# EAGLE board EurocardBackplane-V1_0 (EAGLE 6.5.0)
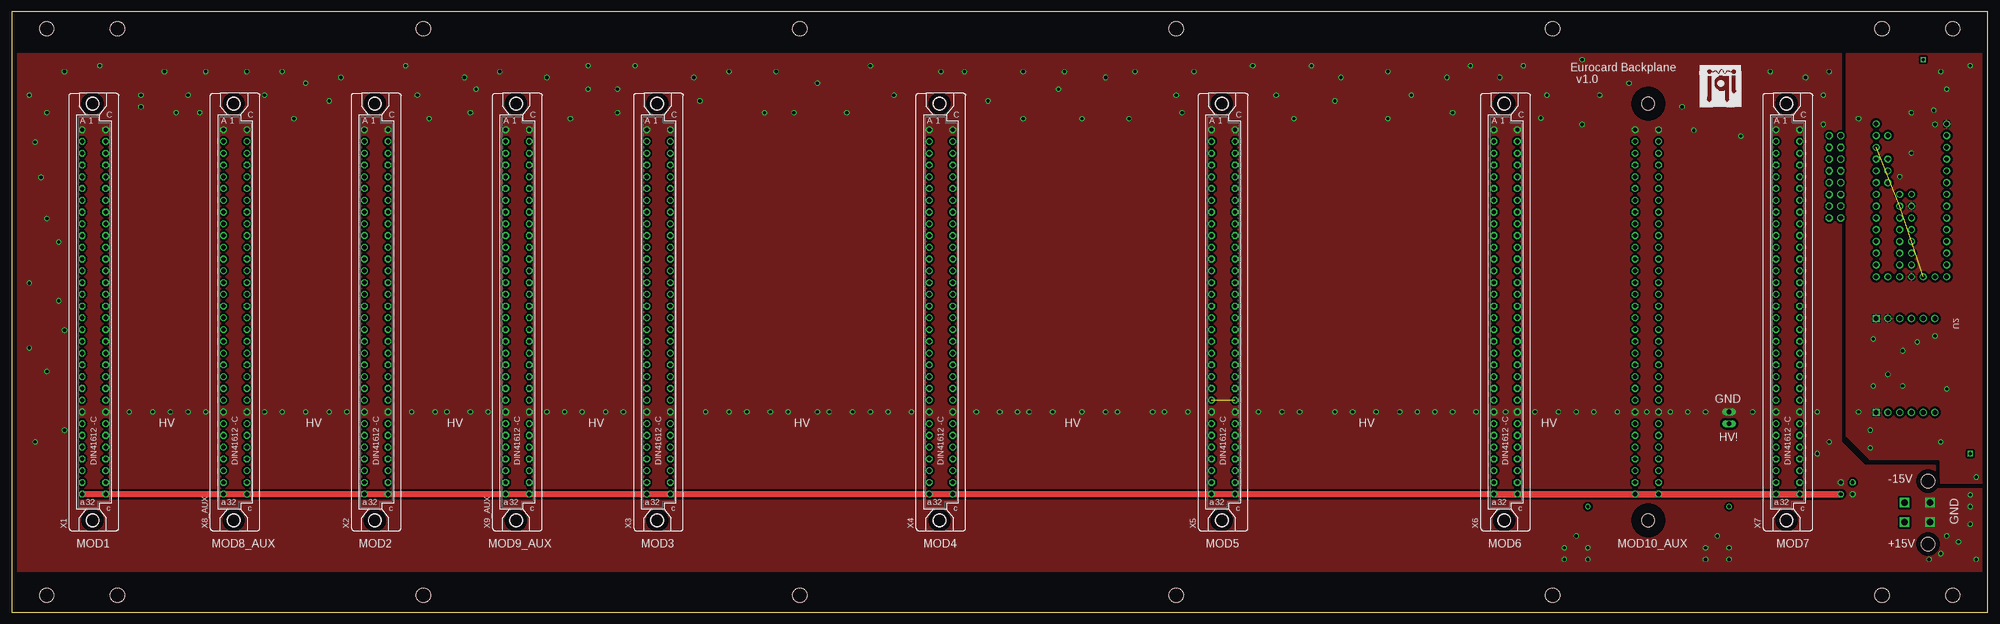
[diagram p3: board, top side]
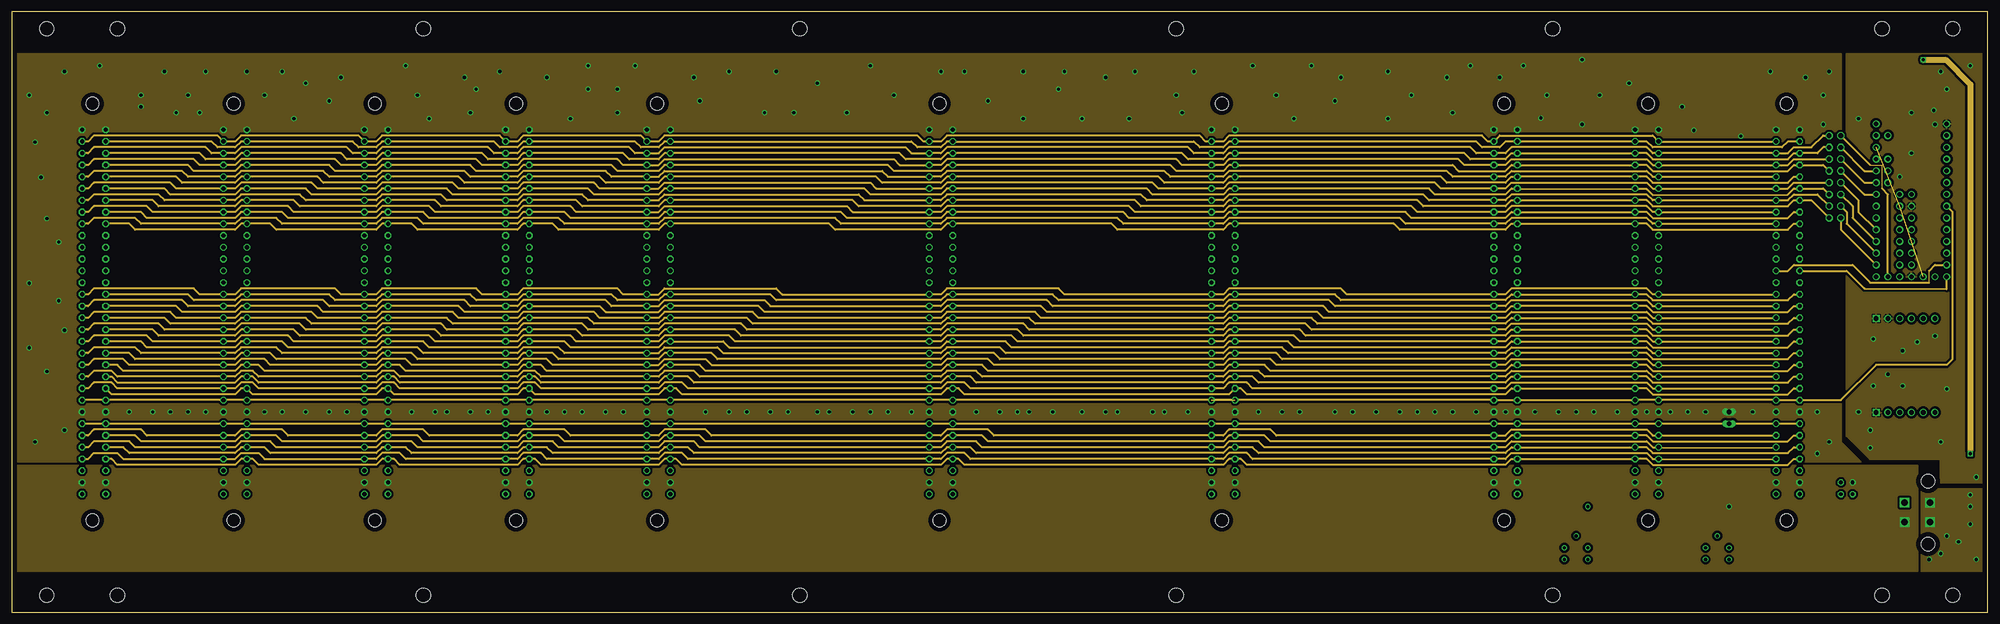
[diagram p4: board, inner layer Route2]
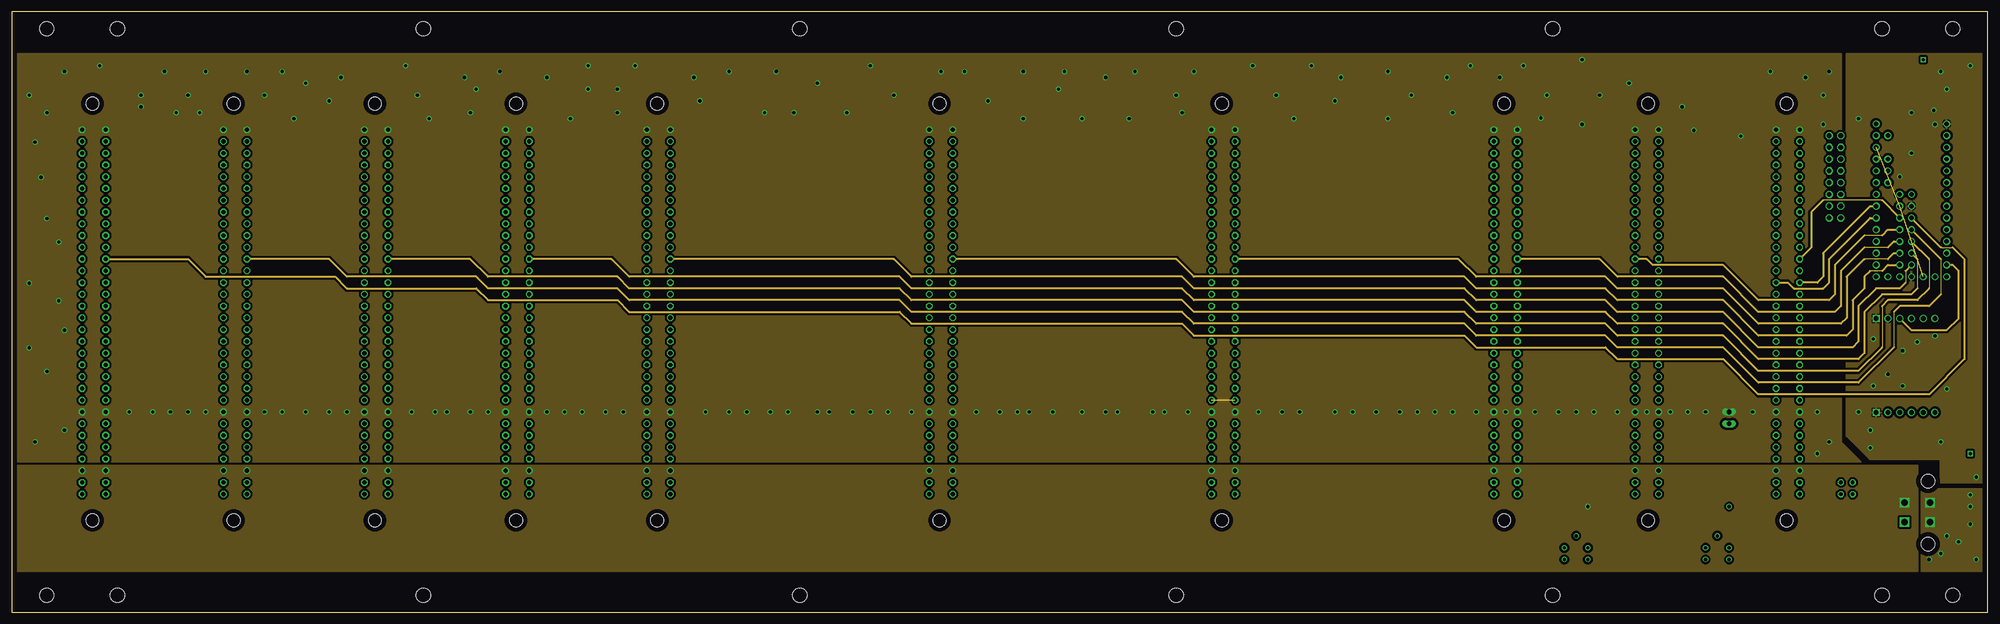
[diagram p5: board, inner layer Route15]
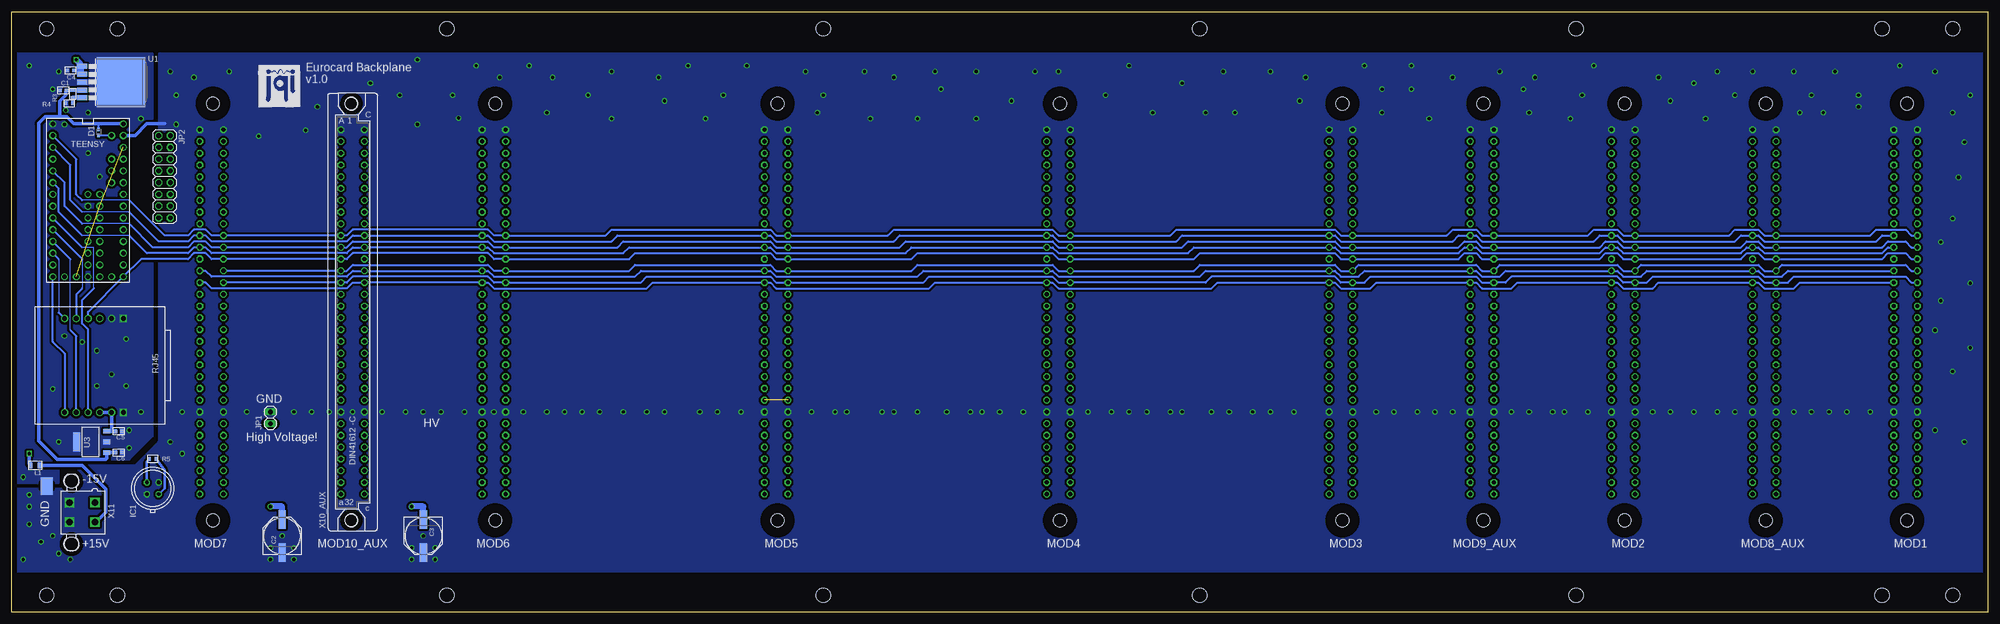
[diagram p6: board, bottom side, seen from below]

Size 426.72 x 129.79 mm. Coordinates in mm from the lower left corner, seen from the top.
Copper layers (1+2*15+16): Top 0.035mm / dielectric 1.5mm / Route2 0.035mm / dielectric 0.15mm / Route15 0.035mm / dielectric 0.2mm / Bottom 0.035mm
Design rules "default": minimum track width 10mil, minimum drill 24mil, track to track 8mil, track to pad 8mil, pad to pad 8mil, via to via 8mil, smd to smd 8mil, copper to edge 40mil, drill to drill 8mil, minimum pad ring 10mil, minimum via ring 8mil, stop-mask expansion 4mil, vias tented up to drill 0mil, thermal gap 10mil

## Footprints (pad centres in the part's own frame; a part is rotated, then mirrored left to right if it is on the bottom)
C_MLCC_0603 = smd 0.8 x 0.8: P$1 -0.75,0; P$2 0.75,0
PANASONIC_F = smd 4 x 1.6: + 3.55,0; - -3.55,0
SOD523 = smd 0.7 x 0.5: A 0.7,0; C -0.6,0
TO39/4 = drill 0.813 octagon: 1 -1.27,-1.27; 2 1.27,-1.27; 3 1.27,1.27; 4 -1.27,1.27
JUMP = smd 2.54 x 2.54: P$1 0,-1.27; P$2 0,0
1X02 = drill 1.016 long: 1 -1.27,0; 2 1.27,0
2X08 = drill 1.016 octagon: 1 -8.89,-1.27; 2 -8.89,1.27; 3 -6.35,-1.27; 4 -6.35,1.27; 5 -3.81,-1.27; 6 -3.81,1.27; 7 -1.27,-1.27; 8 -1.27,1.27; 9 1.27,-1.27; 10 1.27,1.27; 11 3.81,-1.27; 12 3.81,1.27; 13 6.35,-1.27; 14 6.35,1.27; 15 8.89,-1.27; 16 8.89,1.27
R_0805 = smd 0.7 x 1.3: P$1 -0.95,0; P$2 0.95,0
R_0603 = smd 0.6 x 0.9: P$1 -0.75,0; P$2 0.75,0
TEENSY_3.1_ALLPINS = drill 0.965: 0 -7.62,15.24; 1 -7.62,12.7; 2 -7.62,10.16; 3 -7.62,7.62; 3.3V 7.62,12.7; 3.3V1 -2.54,-15.24; 3.3V2 2.54,0; 4 -7.62,5.08; 5 -7.62,2.54; 6 -7.62,0; 7 -7.62,-2.54; 8 -7.62,-5.08; 9 -7.62,-7.62; 10 -7.62,-10.16; 11 -7.62,-12.7; 12 -7.62,-15.24; 13 7.62,-15.24; 14/A0 7.62,-12.7; 15/A1 7.62,-10.16; 16/A2 7.62,-7.62; 17/A3 7.62,-5.08; 18/A4 7.62,-2.54; 19/A5 7.62,0; 20/A6 7.62,2.54; 21/A7 7.62,5.08; 22/A8 7.62,7.62; 23/A9 7.62,10.16; 24 0,-2.54; 25 0,-5.08; 26 0,-7.62; 27 0,-10.16; 28 0,-12.7; 29 2.54,-12.7; 30 2.54,-10.16; 31 2.54,-7.62; 32 2.54,-5.08; 33 2.54,-2.54; A10 5.08,7.62; A11 5.08,5.08; A12 0,2.54; A13 2.54,2.54; A14 5.08,-15.24; AGND 7.62,15.24; AREF 5.08,10.16; GND -7.62,17.78; GND1 0,-15.24; GND2 0,0; PGM 2.54,-15.24; VBAT -5.08,-15.24; VIN 7.62,17.78; VUSB 5.08,15.24
TO263-5 = smd 1.067 x 2.159: 1 -3.404,-5.791; 2 -1.702,-5.791; 3 0,-5.791; 4 1.702,-5.791; 5 3.404,-5.791 | smd 10.8 x 10.41: 6 0,2.54
WIZNET = drill 1.016: 3V3A 10.16,5.08; 3V3B 10.16,2.54; GND2 -10.16,5.08; INT -10.16,-5.08; MISO 10.16,-5.08; MOSI -10.16,2.54; PWDN 10.16,0; RESET 10.16,-2.54; SCLK -10.16,0; SS -10.16,-2.54 | drill 1.016 square: GND1 -10.16,7.62; GND3 10.16,7.62
SOT223-S = smd 1 x 1.5: 1 -2.3,-1.5; 2 0,-1.5; 3 2.3,-1.5 | smd 4 x 1.5: 4 0,5
BACKPLANE = hole 3.099: 7.62,126.111; 22.86,126.111; 88.9,126.111; 170.18,126.111; 251.46,126.111; 332.74,126.111; 419.1,126.111; 403.86,126.111; 7.62,3.683; 22.86,3.683; 88.9,3.683; 170.18,3.683; 251.46,3.683; 332.74,3.683; 419.1,3.683; 403.86,3.683
FAC64S = drill 0.914 octagon: A1 -2.54,39.37; A2 -2.54,36.83; A3 -2.54,34.29; A4 -2.54,31.75; A5 -2.54,29.21; A6 -2.54,26.67; A7 -2.54,24.13; A8 -2.54,21.59; A9 -2.54,19.05; A10 -2.54,16.51; A11 -2.54,13.97; A12 -2.54,11.43; A13 -2.54,8.89; A14 -2.54,6.35; A15 -2.54,3.81; A16 -2.54,1.27; A17 -2.54,-1.27; A18 -2.54,-3.81; A19 -2.54,-6.35; A20 -2.54,-8.89; A21 -2.54,-11.43; A22 -2.54,-13.97; A23 -2.54,-16.51; A24 -2.54,-19.05; A25 -2.54,-21.59; A26 -2.54,-24.13; A27 -2.54,-26.67; A28 -2.54,-29.21; A29 -2.54,-31.75; A30 -2.54,-34.29; A31 -2.54,-36.83; A32 -2.54,-39.37; C1 2.54,39.37; C2 2.54,36.83; C3 2.54,34.29; C4 2.54,31.75; C5 2.54,29.21; C6 2.54,26.67; C7 2.54,24.13; C8 2.54,21.59; C9 2.54,19.05; C10 2.54,16.51; C11 2.54,13.97; C12 2.54,11.43; C13 2.54,8.89; C14 2.54,6.35; C15 2.54,3.81; C16 2.54,1.27; C17 2.54,-1.27; C18 2.54,-3.81; C19 2.54,-6.35; C20 2.54,-8.89; C21 2.54,-11.43; C22 2.54,-13.97; C23 2.54,-16.51; C24 2.54,-19.05; C25 2.54,-21.59; C26 2.54,-24.13; C27 2.54,-26.67; C28 2.54,-29.21; C29 2.54,-31.75; C30 2.54,-34.29; C31 2.54,-36.83; C32 2.54,-39.37 | hole 2.794: -0.305,45.009; -0.305,-45.009
5566-4 = drill 1.4 square: 1 2.1,-2.75; 2 -2.1,-2.75; 3 2.1,2.75; 4 -2.1,2.75 | hole 3: 6.8,2.29; -6.8,2.29

## Placement (x,y rotation side)
C1  1uF  [C_MLCC_0603]  415.54,112.78 0 bottom
C2  [PANASONIC_F]  368.3,16.51 90 bottom
C3  [PANASONIC_F]  337.82,16.51 270 bottom
C4  1uF  [C_MLCC_0603]  414.02,117.09 0 bottom
C5  1uF  [C_MLCC_0603]  403.61,39.12 180 bottom
C6  1uF  [C_MLCC_0603]  403.61,34.54 180 bottom
D1  [SOD523]  407.92,103.76 270 bottom
IC1  LM399H  [TO39/4]  396.24,26.8 90 bottom
J1  JUMPER  [JUMP]  419.1,26.67 180 bottom
JP1  [1X02]  370.84,42.04 90 bottom
JP2  [2X08]  393.7,94.11 270 bottom
L1  [R_0805]  421.64,31.75 180 bottom
R3  [R_0603]  413.51,112.01 90 bottom
R4  [R_0603]  414.27,109.98 0 bottom
R5  7.5k  [R_0603]  396.24,33.15 180 bottom
TEENSY  TEENSY_3.1_ALL_PINS_AND_PADS  [TEENSY_3.1_ALLPINS]  410.21,87.76 0 bottom
U1  MIC5209  [TO263-5]  405.64,114.55 270 bottom
U2  WIZ820IO  [WIZNET]  410.21,53.34 270 bottom
U3  MIC5209-3.3YS  [SOT223-S]  407.67,36.83 90 bottom
U$1  [JQI_LOGO_NEGATIVE-SILKSCREEN]  364.49,109.22 0 top
U$3  [BACKPLANE]  0,0 0 top
U$4  [JQI_LOGO_NEGATIVE-SILKSCREEN]  373.38,109.22 0 bottom
X1  FAC64S  [FAC64S]  17.78,64.9 0 top
X2  FAC64S  [FAC64S]  78.74,64.9 0 top
X3  FAC64S  [FAC64S]  139.7,64.9 0 top
X4  FAC64S  [FAC64S]  200.66,64.9 0 top
X5  FAC64S  [FAC64S]  261.62,64.9 0 top
X6  FAC64S  [FAC64S]  322.58,64.9 0 top
X7  FAC64S  [FAC64S]  383.54,64.9 0 top
X8_AUX  FAC64S  [FAC64S]  48.26,64.9 0 top
X9_AUX  FAC64S  [FAC64S]  109.22,64.9 0 top
X10_AUX  FAC64S  [FAC64S]  353.06,64.9 0 bottom
X11  [5566-4]  411.48,21.59 90 bottom

## Tracks (layer width: path | path; a pad name or v marks a point on that pad's centre or on a via)
3.3V  (2 unrouted)
+3V3
  Bottom 0.762: C5.P$2 405.13,39.12 | 405.13,39.12 406.16,39.12 U3.3 | U2.3V3B U2.3V3A 405.13,39.12
+15V  (via drill 0.7)
  Bottom 0.508: IC1.3 397.51,32.5 R5.P$2
  Bottom 0.762: L1.P$1 411.48,31.75 406.4,26.67 406.4,21.59 408.5,19.49 X11.2
  Bottom 1.27: C2.+ 368.3,22.86 v370.84,22.86
  pour Route2 (isolate 0.508, no thermals): 411.48,31.75 411.48,8.89 0,8.89 0,31.75
-15V  (via drill 0.7)
  Bottom 1.27: C3.- 337.82,22.86 v340.36,22.86
  pour Route15 (isolate 0.508, no thermals): 411.48,31.75 411.48,8.89 0,8.89 0,31.75
A2
  Route2 0.406: 380.87,101.6 X7.A2 X10_AUX.A2 354.33,103 321.31,103 X6.A2 318.77,101.73 317.5,103 262.89,103 261.62,101.73 X5.A2 257.81,101.73 256.54,103 201.93,103 200.66,101.73 X4.A2 196.85,101.73 195.58,103 140.97,103 139.7,101.73 X3.A2 135.89,103 110.49,103 109.22,101.73 X9_AUX.A2 105.41,103 80.01,103 78.74,101.73 X2.A2 74.93,103 49.53,103 48.26,101.73 X8_AUX.A2 44.45,103 17.78,103 16.51,101.73 X1.A2
A5
  Route2 0.406: X7.A5 X10_AUX.A5 354.33,94.11 353.06,95.38 323.85,95.38 322.58,94.11 X6.A5 311.15,94.11 309.88,95.38 262.89,95.38 261.62,94.11 X5.A5 250.19,94.11 248.92,95.38 201.93,95.38 200.66,94.11 X4.A5 189.23,94.11 187.96,95.38 140.97,95.38 139.7,94.11 X3.A5 129.54,94.11 128.27,95.38 110.49,95.38 109.22,94.11 X9_AUX.A5 99.06,94.11 97.79,95.38 80.01,95.38 78.74,94.11 X2.A5 68.58,94.11 67.31,95.38 49.53,95.38 48.26,94.11 X8_AUX.A5 38.1,94.11 36.83,95.38 17.78,95.38 16.51,94.11 X1.A5
A8
  Route2 0.406: X7.A8 X10_AUX.A8 354.33,86.49 353.06,87.76 323.85,87.76 322.58,86.49 X6.A8 303.53,86.49 302.26,87.76 262.89,87.76 261.62,86.49 X5.A8 242.57,86.49 241.3,87.76 201.93,87.76 200.66,86.49 X4.A8 181.61,86.49 180.34,87.76 140.97,87.76 139.7,86.49 X3.A8 121.92,86.49 120.65,87.76 110.49,87.76 109.22,86.49 X9_AUX.A8 91.44,86.49 90.17,87.76 80.01,87.76 78.74,86.49 X2.A8 60.96,86.49 59.69,87.76 49.53,87.76 48.26,86.49 X8_AUX.A8 30.48,86.49 29.21,87.76 17.78,87.76 16.51,86.49 X1.A8
A9
  Route2 0.406: X7.A9 X10_AUX.A9 354.33,83.95 353.06,85.22 323.85,85.22 322.58,83.95 X6.A9 300.99,83.95 299.72,85.22 262.89,85.22 261.62,83.95 X5.A9 240.03,83.95 238.76,85.22 201.93,85.22 200.66,83.95 X4.A9 179.07,83.95 177.8,85.22 140.97,85.22 139.7,83.95 X3.A9 119.38,83.95 118.11,85.22 110.49,85.22 109.22,83.95 X9_AUX.A9 88.9,83.95 87.63,85.22 80.01,85.22 78.74,83.95 X2.A9 58.42,83.95 57.15,85.22 49.53,85.22 48.26,83.95 X8_AUX.A9 27.94,83.95 26.67,85.22 17.78,85.22 16.51,83.95 X1.A9
A15
  Route2 0.406: X7.A15 X10_AUX.A15 354.33,68.71 353.06,69.98 323.85,69.98 322.58,68.71 X6.A15 288.29,68.71 287.02,69.98 262.89,69.98 261.62,68.71 X5.A15 227.33,68.71 226.06,69.98 201.93,69.98 200.66,68.71 X4.A15 166.37,68.71 165.1,69.98 140.97,69.98 139.7,68.71 X3.A15 132.08,68.71 130.81,69.98 110.49,69.98 109.22,68.71 X9_AUX.A15 101.6,68.71 100.33,69.98 80.01,69.98 78.74,68.71 X2.A15 71.12,68.71 69.85,69.98 49.53,69.98 48.26,68.71 X8_AUX.A15 40.64,68.71 39.37,69.98 17.78,69.98 16.51,68.71 X1.A15
A16
  Route2 0.406: X7.A16 X10_AUX.A16 354.33,66.17 353.06,67.44 323.85,67.44 322.58,66.17 X6.A16 285.75,66.17 284.48,67.44 262.89,67.44 261.62,66.17 X5.A16 224.79,66.17 223.52,67.44 201.93,67.44 200.66,66.17 X4.A16 163.83,66.17 162.56,67.44 140.97,67.44 139.7,66.17 X3.A16 129.54,66.17 128.27,67.44 110.49,67.44 109.22,66.17 X9_AUX.A16 99.06,66.17 97.79,67.44 80.01,67.44 78.74,66.17 X2.A16 68.58,66.17 67.31,67.44 49.53,67.44 48.26,66.17 X8_AUX.A16 38.1,66.17 36.83,67.44 17.78,67.44 16.51,66.17 X1.A16
A17
  Route2 0.406: X7.A17 X10_AUX.A17 354.33,63.63 353.06,64.9 323.85,64.9 322.58,63.63 X6.A17 283.21,63.63 281.94,64.9 262.89,64.9 261.62,63.63 X5.A17 222.25,63.63 220.98,64.9 201.93,64.9 200.66,63.63 X4.A17 161.29,63.63 160.02,64.9 140.97,64.9 139.7,63.63 X3.A17 127,63.63 125.73,64.9 110.49,64.9 109.22,63.63 X9_AUX.A17 96.52,63.63 95.25,64.9 80.01,64.9 78.74,63.63 X2.A17 66.04,63.63 64.77,64.9 49.53,64.9 48.26,63.63 X8_AUX.A17 35.56,63.63 34.29,64.9 17.78,64.9 16.51,63.63 X1.A17
A18
  Route2 0.406: X7.A18 X10_AUX.A18 354.33,61.09 353.06,62.36 323.85,62.36 322.58,61.09 X6.A18 280.67,61.09 279.4,62.36 262.89,62.36 261.62,61.09 X5.A18 219.71,61.09 218.44,62.36 201.93,62.36 200.66,61.09 X4.A18 158.75,61.09 157.48,62.36 140.97,62.36 139.7,61.09 X3.A18 124.46,61.09 123.19,62.36 110.49,62.36 109.22,61.09 X9_AUX.A18 93.98,61.09 92.71,62.36 80.01,62.36 78.74,61.09 X2.A18 63.5,61.09 62.23,62.36 49.53,62.36 48.26,61.09 X8_AUX.A18 33.02,61.09 31.75,62.36 17.78,62.36 16.51,61.09 X1.A18
A19
  Route2 0.406: X7.A19 X10_AUX.A19 354.33,58.55 353.06,59.82 323.85,59.82 322.58,58.55 X6.A19 278.13,58.55 276.86,59.82 262.89,59.82 261.62,58.55 X5.A19 217.17,58.55 215.9,59.82 201.93,59.82 200.66,58.55 X4.A19 156.21,58.55 154.94,59.82 140.97,59.82 139.7,58.55 X3.A19 121.92,58.55 120.65,59.82 110.49,59.82 109.22,58.55 X9_AUX.A19 91.44,58.55 90.17,59.82 80.01,59.82 78.74,58.55 X2.A19 60.96,58.55 59.69,59.82 49.53,59.82 48.26,58.55 X8_AUX.A19 30.48,58.55 29.21,59.82 17.78,59.82 16.51,58.55 X1.A19
A20
  Route2 0.406: X7.A20 X10_AUX.A20 354.33,56.01 353.06,57.28 323.85,57.28 322.58,56.01 X6.A20 275.59,56.01 274.32,57.28 262.89,57.28 261.62,56.01 X5.A20 214.63,56.01 213.36,57.28 201.93,57.28 200.66,56.01 X4.A20 153.67,56.01 152.4,57.28 140.97,57.28 139.7,56.01 X3.A20 119.38,56.01 118.11,57.28 110.49,57.28 109.22,56.01 X9_AUX.A20 88.9,56.01 87.63,57.28 80.01,57.28 78.74,56.01 X2.A20 58.42,56.01 57.15,57.28 49.53,57.28 48.26,56.01 X8_AUX.A20 27.94,56.01 26.67,57.28 17.78,57.28 16.51,56.01 X1.A20
A21
  Route2 0.406: X7.A21 381,53.34 X10_AUX.A21 354.33,53.47 353.06,54.74 323.85,54.74 322.58,53.47 X6.A21 273.05,53.47 271.78,54.74 262.89,54.74 261.62,53.47 X5.A21 212.09,53.47 210.82,54.74 201.93,54.74 200.66,53.47 X4.A21 151.13,53.47 149.86,54.74 140.97,54.74 139.7,53.47 X3.A21 116.84,53.47 115.57,54.74 110.49,54.74 109.22,53.47 X9_AUX.A21 86.36,53.47 85.09,54.74 80.01,54.74 78.74,53.47 X2.A21 55.88,53.47 54.61,54.74 49.53,54.74 48.26,53.47 X8_AUX.A21 25.4,53.47 24.13,54.74 17.78,54.74 16.51,53.47 X1.A21
A22
  Route2 0.406: X7.A22 X10_AUX.A22 354.33,50.93 353.06,52.2 323.85,52.2 322.58,50.93 X6.A22 270.51,50.93 269.24,52.2 262.89,52.2 261.62,50.93 X5.A22 209.55,50.93 208.28,52.2 201.93,52.2 200.66,50.93 X4.A22 148.59,50.93 147.32,52.2 140.97,52.2 139.7,50.93 X3.A22 114.3,50.93 113.03,52.2 110.49,52.2 109.22,50.93 X9_AUX.A22 83.82,50.93 82.55,52.2 80.01,52.2 78.74,50.93 X2.A22 53.34,50.93 52.07,52.2 49.53,52.2 48.26,50.93 X8_AUX.A22 22.86,50.93 21.59,52.2 17.78,52.2 16.51,50.93 X1.A22
A23
  Route2 0.406: X7.A23 X10_AUX.A23 354.33,48.39 353.06,49.66 323.85,49.66 322.58,48.39 X6.A23 267.97,48.39 266.7,49.66 262.89,49.66 261.62,48.39 X5.A23 207.01,48.39 205.74,49.66 201.93,49.66 200.66,48.39 X4.A23 146.05,48.39 144.78,49.66 140.97,49.66 139.7,48.39 X3.A23 114.3,48.39 113.03,49.66 110.49,49.66 109.22,48.39 X9_AUX.A23 83.82,48.39 82.55,49.66 80.01,49.66 78.74,48.39 X2.A23 53.34,48.39 52.07,49.66 49.53,49.66 48.26,48.39 X8_AUX.A23 22.86,48.39 21.59,49.66 17.78,49.66 16.51,48.39 X1.A23
A27
  Route2 0.406: X7.A27 X10_AUX.A27 354.33,38.23 353.06,39.5 323.85,39.5 322.58,38.23 X6.A27 273.05,38.23 271.78,39.5 262.89,39.5 261.62,38.23 X5.A27 212.09,38.23 210.82,39.5 201.93,39.5 200.66,38.23 X4.A27 151.13,38.23 149.86,39.5 140.97,39.5 139.7,38.23 X3.A27 120.65,38.23 119.38,39.5 110.49,39.5 109.22,38.23 X9_AUX.A27 90.17,38.23 88.9,39.5 80.01,39.5 78.74,38.23 X2.A27 59.69,38.23 58.42,39.5 49.53,39.5 48.26,38.23 X8_AUX.A27 29.21,38.23 27.94,39.5 17.78,39.5 16.51,38.23 X1.A27
A28
  Route2 0.406: X7.A28 381,35.56 X10_AUX.A28 354.33,35.69 353.06,36.96 323.85,36.96 322.58,35.69 X6.A28 270.51,35.69 269.24,36.96 262.89,36.96 261.62,35.69 X5.A28 209.55,35.69 208.28,36.96 201.93,36.96 200.66,35.69 X4.A28 148.59,35.69 147.32,36.96 140.97,36.96 139.7,35.69 X3.A28 118.11,35.69 116.84,36.96 110.49,36.96 109.22,35.69 X9_AUX.A28 87.63,35.69 86.36,36.96 80.01,36.96 78.74,35.69 X2.A28 57.15,35.69 55.88,36.96 49.53,36.96 48.26,35.69 X8_AUX.A28 26.67,35.69 25.4,36.96 17.78,36.96 16.51,35.69 X1.A28
A29
  Route2 0.406: X7.A29 381,33.02 X10_AUX.A29 354.33,33.15 353.06,34.42 323.85,34.42 322.58,33.15 X6.A29 267.97,33.15 266.7,34.42 262.89,34.42 261.62,33.15 X5.A29 207.01,33.15 205.74,34.42 201.93,34.42 200.66,33.15 X4.A29 146.05,33.15 144.78,34.42 140.97,34.42 139.7,33.15 X3.A29 115.57,33.15 114.3,34.42 110.49,34.42 109.22,33.15 X9_AUX.A29 85.09,33.15 83.82,34.42 80.01,34.42 78.74,33.15 X2.A29 54.61,33.15 53.34,34.42 49.53,34.42 48.26,33.15 X8_AUX.A29 24.13,33.15 22.86,34.42 17.78,34.42 16.51,33.15 X1.A29
C2
  Route2 0.406: 386.08,101.6 X7.C2 383.54,101.73 382.27,100.46 354.33,100.46 353.06,101.73 X10_AUX.C2 X6.C2 | 325.25,101.6 X6.C2 | X6.C2 322.58,101.73 321.31,100.46 317.5,100.46 316.23,101.73 X5.C2 262.89,101.73 261.62,100.46 256.54,100.46 255.27,101.73 X4.C2 201.93,101.73 200.66,100.46 195.58,100.46 194.31,101.73 X3.C2 140.97,101.73 139.7,100.46 135.89,100.46 134.62,101.73 X9_AUX.C2 110.49,101.73 109.22,100.46 105.41,100.46 104.14,101.73 X2.C2 80.01,101.73 78.74,100.46 74.93,100.46 73.66,101.73 X8_AUX.C2 49.53,101.73 48.26,100.46 44.45,100.46 43.18,101.73 X1.C2
C5
  Route2 0.406: 386.08,93.98 X7.C5 384.81,94.11 383.54,92.84 354.33,92.84 353.06,94.11 X10_AUX.C5 X6.C5 323.85,94.11 322.58,92.84 309.88,92.84 308.61,94.11 X5.C5 262.89,94.11 261.62,92.84 248.92,92.84 247.65,94.11 X4.C5 201.93,94.11 200.66,92.84 187.96,92.84 186.69,94.11 X3.C5 140.97,94.11 139.7,92.84 128.27,92.84 127,94.11 X9_AUX.C5 110.49,94.11 109.22,92.84 97.79,92.84 96.52,94.11 X2.C5 80.01,94.11 78.74,92.84 67.31,92.84 66.04,94.11 X8_AUX.C5 49.53,94.11 48.26,92.84 36.83,92.84 35.56,94.11 X1.C5
C8
  Route2 0.406: X7.C8 384.81,86.49 383.54,85.22 354.33,85.22 353.06,86.49 X10_AUX.C8 X6.C8 323.85,86.49 322.58,85.22 302.26,85.22 300.99,86.49 X5.C8 262.89,86.49 261.62,85.22 241.3,85.22 240.03,86.49 X4.C8 201.93,86.49 200.66,85.22 180.34,85.22 179.07,86.49 X3.C8 140.97,86.49 139.7,85.22 120.65,85.22 119.38,86.49 X9_AUX.C8 110.49,86.49 109.22,85.22 90.17,85.22 88.9,86.49 X2.C8 80.01,86.49 78.74,85.22 59.69,85.22 58.42,86.49 X8_AUX.C8 49.53,86.49 48.26,85.22 29.21,85.22 27.94,86.49 X1.C8
C9
  Route2 0.406: X7.C9 384.81,83.95 383.54,82.68 354.33,82.68 353.06,83.95 X10_AUX.C9 X6.C9 323.85,83.95 322.58,82.68 299.72,82.68 298.45,83.95 X5.C9 262.89,83.95 261.62,82.68 238.76,82.68 237.49,83.95 X4.C9 201.93,83.95 200.66,82.68 177.8,82.68 176.53,83.95 X3.C9 140.97,83.95 139.7,82.68 118.11,82.68 116.84,83.95 X9_AUX.C9 110.49,83.95 109.22,82.68 87.63,82.68 86.36,83.95 X2.C9 80.01,83.95 78.74,82.68 57.15,82.68 55.88,83.95 X8_AUX.C9 49.53,83.95 48.26,82.68 26.67,82.68 25.4,83.95 X1.C9
C15
  Route2 0.406: X7.C15 384.81,68.71 383.54,67.44 354.33,67.44 353.06,68.71 X10_AUX.C15 X6.C15 323.85,68.71 322.58,67.44 287.02,67.44 285.75,68.71 X5.C15 262.89,68.71 261.62,67.44 226.06,67.44 224.79,68.71 X4.C15 201.93,68.71 200.66,67.44 165.1,67.44 163.83,68.71 X3.C15 140.97,68.71 139.7,67.44 130.81,67.44 129.54,68.71 X9_AUX.C15 110.49,68.71 109.22,67.44 100.33,67.44 99.06,68.71 X2.C15 80.01,68.71 78.74,67.44 69.85,67.44 68.58,68.71 X8_AUX.C15 49.53,68.71 48.26,67.44 39.37,67.44 38.1,68.71 X1.C15
C16
  Route2 0.406: X7.C16 384.81,66.17 383.54,64.9 354.33,64.9 353.06,66.17 X10_AUX.C16 | 350.39,66.17 X10_AUX.C16 | X10_AUX.C16 X6.C16 323.85,66.17 322.58,64.9 284.48,64.9 283.21,66.17 X5.C16 262.89,66.17 261.62,64.9 223.52,64.9 222.25,66.17 X4.C16 201.93,66.17 200.66,64.9 162.56,64.9 161.29,66.17 X3.C16 140.97,66.17 139.7,64.9 128.27,64.9 127,66.17 X9_AUX.C16 110.49,66.17 109.22,64.9 97.79,64.9 96.52,66.17 X2.C16 80.01,66.17 78.74,64.9 67.31,64.9 66.04,66.17 X8_AUX.C16 49.53,66.17 48.26,64.9 36.83,64.9 35.56,66.17 X1.C16
C17
  Route2 0.406: X7.C17 384.81,63.63 383.54,62.36 354.33,62.36 353.06,63.63 X10_AUX.C17 X6.C17 323.85,63.63 322.58,62.36 281.94,62.36 280.67,63.63 X5.C17 262.89,63.63 261.62,62.36 220.98,62.36 219.71,63.63 X4.C17 201.93,63.63 200.66,62.36 160.02,62.36 158.75,63.63 X3.C17 140.97,63.63 139.7,62.36 125.73,62.36 124.46,63.63 X9_AUX.C17 110.49,63.63 109.22,62.36 95.25,62.36 93.98,63.63 X2.C17 80.01,63.63 78.74,62.36 64.77,62.36 63.5,63.63 X8_AUX.C17 49.53,63.63 48.26,62.36 34.29,62.36 33.02,63.63 X1.C17
C18
  Route2 0.406: X7.C18 384.81,61.09 383.54,59.82 354.33,59.82 353.06,61.09 X10_AUX.C18 X6.C18 323.85,61.09 322.58,59.82 279.4,59.82 278.13,61.09 X5.C18 262.89,61.09 261.62,59.82 218.44,59.82 217.17,61.09 X4.C18 201.93,61.09 200.66,59.82 157.48,59.82 156.21,61.09 X3.C18 140.97,61.09 139.7,59.82 123.19,59.82 121.92,61.09 X9_AUX.C18 110.49,61.09 109.22,59.82 92.71,59.82 91.44,61.09 X2.C18 80.01,61.09 78.74,59.82 62.23,59.82 60.96,61.09 X8_AUX.C18 49.53,61.09 48.26,59.82 31.75,59.82 30.48,61.09 X1.C18
C19
  Route2 0.406: X7.C19 384.81,58.55 383.54,57.28 354.33,57.28 353.06,58.55 X10_AUX.C19 X6.C19 323.85,58.55 322.58,57.28 276.86,57.28 275.59,58.55 X5.C19 262.89,58.55 261.62,57.28 215.9,57.28 214.63,58.55 X4.C19 201.93,58.55 200.66,57.28 154.94,57.28 153.67,58.55 X3.C19 140.97,58.55 139.7,57.28 120.65,57.28 119.38,58.55 X9_AUX.C19 110.49,58.55 109.22,57.28 90.17,57.28 88.9,58.55 X2.C19 80.01,58.55 78.74,57.28 59.69,57.28 58.42,58.55 X8_AUX.C19 49.53,58.55 48.26,57.28 29.21,57.28 27.94,58.55 X1.C19
C20
  Route2 0.406: X7.C20 384.81,56.01 383.54,54.74 354.33,54.74 353.06,56.01 X10_AUX.C20 X6.C20 323.85,56.01 322.58,54.74 274.32,54.74 273.05,56.01 X5.C20 262.89,56.01 261.62,54.74 213.36,54.74 212.09,56.01 X4.C20 201.93,56.01 200.66,54.74 152.4,54.74 151.13,56.01 X3.C20 140.97,56.01 139.7,54.74 118.11,54.74 116.84,56.01 X9_AUX.C20 110.49,56.01 109.22,54.74 87.63,54.74 86.36,56.01 X2.C20 80.01,56.01 78.74,54.74 57.15,54.74 55.88,56.01 X8_AUX.C20 49.53,56.01 48.26,54.74 26.67,54.74 25.4,56.01 X1.C20
C21
  Route2 0.406: X7.C21 384.81,53.47 383.54,52.2 354.33,52.2 353.06,53.47 X10_AUX.C21 X6.C21 323.85,53.47 322.58,52.2 271.78,52.2 270.51,53.47 X5.C21 262.89,53.47 261.62,52.2 210.82,52.2 209.55,53.47 X4.C21 201.93,53.47 200.66,52.2 149.86,52.2 148.59,53.47 X3.C21 140.97,53.47 139.7,52.2 115.57,52.2 114.3,53.47 X9_AUX.C21 110.49,53.47 109.22,52.2 85.09,52.2 83.82,53.47 X2.C21 80.01,53.47 78.74,52.2 54.61,52.2 53.34,53.47 X8_AUX.C21 49.53,53.47 48.26,52.2 24.13,52.2 22.86,53.47 X1.C21
C22
  Route2 0.406: X7.C22 384.81,50.93 383.54,49.66 354.33,49.66 353.06,50.93 X10_AUX.C22 X6.C22 323.85,50.93 322.58,49.66 269.24,49.66 267.97,50.93 X5.C22 262.89,50.93 261.62,49.66 208.28,49.66 207.01,50.93 X4.C22 201.93,50.93 200.66,49.66 147.32,49.66 146.05,50.93 X3.C22 140.97,50.93 139.7,49.66 114.3,49.66 113.03,50.93 X9_AUX.C22 110.49,50.93 109.22,49.66 83.82,49.66 82.55,50.93 X2.C22 80.01,50.93 78.74,49.66 53.34,49.66 52.07,50.93 X8_AUX.C22 49.53,50.93 48.26,49.66 22.86,49.66 21.59,50.93 X1.C22
C23
  Route2 0.406: X7.C23 384.81,48.39 383.54,47.12 354.33,47.12 353.06,48.39 X10_AUX.C23 X6.C23 323.85,48.39 322.58,47.12 266.7,47.12 265.43,48.39 X5.C23 262.89,47.12 205.74,47.12 204.47,48.39 X4.C23 201.93,48.39 200.66,47.12 144.78,47.12 143.51,48.39 X3.C23 140.97,48.39 139.7,47.12 113.03,47.12 X9_AUX.C23 110.49,48.39 109.22,47.12 82.55,47.12 X2.C23 80.01,48.39 78.74,47.12 52.07,47.12 X8_AUX.C23 49.53,48.39 48.26,47.12 21.59,47.12 X1.C23
C27
  Route2 0.406: X7.C27 384.81,38.23 383.54,36.96 354.33,36.96 353.06,38.23 X10_AUX.C27 X6.C27 323.85,38.23 322.58,36.96 271.78,36.96 270.51,38.23 X5.C27 262.89,38.23 261.62,36.96 210.82,36.96 209.55,38.23 X4.C27 201.93,38.23 200.66,36.96 149.86,36.96 148.59,38.23 X3.C27 140.97,38.23 139.7,36.96 119.38,36.96 118.11,38.23 X9_AUX.C27 110.49,38.23 109.22,36.96 88.9,36.96 87.63,38.23 X2.C27 80.01,38.23 78.74,36.96 58.42,36.96 57.15,38.23 X8_AUX.C27 49.53,38.23 48.26,36.96 27.94,36.96 26.67,38.23 X1.C27
C28
  Route2 0.406: X7.C28 384.81,35.69 383.54,34.42 354.33,34.42 353.06,35.69 X10_AUX.C28 X6.C28 323.85,35.69 322.58,34.42 269.24,34.42 267.97,35.69 X5.C28 262.89,35.69 261.62,34.42 208.28,34.42 207.01,35.69 X4.C28 201.93,35.69 200.66,34.42 147.32,34.42 146.05,35.69 X3.C28 140.97,35.69 139.7,34.42 116.84,34.42 115.57,35.69 X9_AUX.C28 110.49,35.69 109.22,34.42 86.36,34.42 85.09,35.69 X2.C28 80.01,35.69 78.74,34.42 55.88,34.42 54.61,35.69 X8_AUX.C28 49.53,35.69 48.26,34.42 25.4,34.42 24.13,35.69 X1.C28
C29
  Route2 0.406: X7.C29 384.81,33.15 383.54,31.88 354.33,31.88 353.06,33.15 X10_AUX.C29 X6.C29 323.85,33.15 322.58,31.88 266.7,31.88 265.43,33.15 X5.C29 262.89,33.15 261.62,31.88 205.74,31.88 204.47,33.15 X4.C29 201.93,33.15 200.66,31.88 144.78,31.88 143.51,33.15 X3.C29 140.97,33.15 139.7,31.88 114.3,31.88 113.03,33.15 X9_AUX.C29 110.49,33.15 109.22,31.88 83.82,31.88 82.55,33.15 X2.C29 80.01,33.15 78.74,31.88 53.34,31.88 52.07,33.15 X8_AUX.C29 49.53,33.15 48.26,31.88 22.86,31.88 21.59,33.15 X1.C29
D0
  Bottom 0.254: 401.32,89.03 411.48,89.03
  Bottom 0.406: TEENSY.0 412.75,97.92 412.75,90.3 411.48,89.03 | 401.32,89.03 393.7,81.41 388.62,81.41 387.35,82.68 384.81,82.68 383.54,81.41 X7.A10 X10_AUX.A10 354.33,81.41 353.06,82.68 323.85,82.68 322.58,81.41 X6.A10 298.45,81.41 297.18,82.68 262.89,82.68 261.62,81.41 X5.A10 237.49,81.41 236.22,82.68 201.93,82.68 200.66,81.41 X4.A10 176.53,81.41 175.26,82.68 140.97,82.68 139.7,81.41 X3.A10 116.84,81.41 115.57,82.68 110.49,82.68 109.22,81.41 X9_AUX.A10 86.36,81.41 85.09,82.68 80.01,82.68 78.74,81.41 X2.A10 55.88,81.41 54.61,82.68 49.53,82.68 48.26,81.41 X8_AUX.A10 25.4,81.41 24.13,82.68 17.78,82.68 16.51,81.41 X1.A10
D1
  Bottom 0.254: 401.32,86.49 411.48,86.49
  Bottom 0.406: TEENSY.1 414.02,96.65 414.02,89.03 411.48,86.49 | 401.32,86.49 394.97,80.14 388.62,80.14 387.35,81.41 X7.C10 384.81,81.41 383.54,80.14 354.33,80.14 353.06,81.41 X10_AUX.C10 X6.C10 323.85,81.41 322.58,80.14 297.18,80.14 295.91,81.41 X5.C10 262.89,81.41 261.62,80.14 236.22,80.14 234.95,81.41 X4.C10 201.93,81.41 200.66,80.14 175.26,80.14 173.99,81.41 X3.C10 140.97,81.41 139.7,80.14 115.57,80.14 114.3,81.41 X9_AUX.C10 110.49,81.41 109.22,80.14 85.09,80.14 83.82,81.41 X2.C10 80.01,81.41 78.74,80.14 54.61,80.14 53.34,81.41 X8_AUX.C10 49.53,81.41 48.26,80.14 24.13,80.14 22.86,81.41 X1.C10
D2
  Bottom 0.254: 401.32,83.95 411.48,83.95
  Bottom 0.406: TEENSY.3 415.29,92.84 415.29,87.76 411.48,83.95 | 401.32,83.95 396.24,78.87 388.62,78.87 387.35,80.14 384.81,80.14 383.54,78.87 X7.A11 X10_AUX.A11 354.33,78.87 353.06,80.14 323.85,80.14 322.58,78.87 X6.A11 295.91,78.87 294.64,80.14 262.89,80.14 261.62,78.87 X5.A11 234.95,78.87 233.68,80.14 201.93,80.14 200.66,78.87 X4.A11 173.99,78.87 172.72,80.14 140.97,80.14 139.7,78.87 X3.A11 114.3,78.87 113.03,80.14 110.49,80.14 109.22,78.87 X9_AUX.A11 83.82,78.87 82.55,80.14 80.01,80.14 78.74,78.87 X2.A11 53.34,78.87 52.07,80.14 49.53,80.14 48.26,78.87 X8_AUX.A11 22.86,78.87 21.59,80.14 17.78,80.14 16.51,78.87 X1.A11
D3
  Bottom 0.254: 401.32,81.41 411.48,81.41
  Bottom 0.406: TEENSY.4 416.56,91.57 416.56,86.49 411.48,81.41 | 401.32,81.41 397.51,77.6 388.62,77.6 387.35,78.87 X7.C11 384.81,78.87 383.54,77.6 354.33,77.6 353.06,78.87 X10_AUX.C11 X6.C11 323.85,78.87 322.58,77.6 294.64,77.6 293.37,78.87 X5.C11 262.89,78.87 261.62,77.6 233.68,77.6 232.41,78.87 X4.C11 201.93,78.87 200.66,77.6 172.72,77.6 171.45,78.87 X3.C11 140.97,78.87 139.7,77.6 114.3,77.6 113.03,78.87 X9_AUX.C11 110.49,78.87 109.22,77.6 83.82,77.6 82.55,78.87 X2.C11 80.01,78.87 78.74,77.6 53.34,77.6 52.07,78.87 X8_AUX.C11 49.53,78.87 48.26,77.6 22.86,77.6 21.59,78.87 X1.C11
GND  (via drill 0.7)
  Route15 0.406: 381,104.14 X7.A1
  Bottom 0.762: TEENSY.AGND 400.05,103 397.51,105.54 393.7,105.54
  other vias: 309.88,115.57 321.31,115.57 311.15,107.95 349.25,114.3 331.47,111.76 339.09,105.41 339.09,119.38 342.9,111.76 363.22,104.14 373.38,102.87 379.73,116.84 387.35,115.57 391.16,111.76 391.16,105.41 392.43,116.84 360.68,109.22 330.2,106.81 297.18,106.68 314.96,118.11 414.02,11.43 420.37,15.24 422.91,22.86 417.83,16.51 424.18,11.43 416.56,12.7 422.91,19.05 370.84,11.43 370.84,13.97 365.76,13.97 365.76,11.43 340.36,11.43 340.36,13.97 335.28,13.97 335.28,11.43 337.82,16.51 368.3,16.51 422.91,25.4 389.89,43.31 392.43,36.83 389.89,34.29 297.18,116.84 302.26,111.76 326.39,118.11 375.92,43.31 365.76,43.31 289.56,43.31 361.95,43.31 358.14,43.31 353.06,43.31 346.71,43.31 341.63,43.31 337.82,43.31 334.01,43.31 328.93,43.31 322.58,43.31 316.23,43.31 307.34,43.31 311.15,43.31 299.72,43.31 294.64,43.31 303.53,43.31 285.75,43.31 278.13,43.31 274.32,43.31 269.24,43.31 254,43.31 248.92,43.31 246.38,43.31 238.76,43.31 236.22,43.31 231.14,43.31 224.79,43.31 219.71,43.31 217.17,43.31 213.36,43.31 208.28,43.31 194.31,43.31 189.23,43.31 185.42,43.31 181.61,43.31 176.53,43.31 173.99,43.31 167.64,43.31 163.83,43.31 158.75,43.31 154.94,43.31 149.86,43.31 132.08,43.31 128.27,43.31 123.19,43.31 119.38,43.31 115.57,43.31 102.87,43.31 99.06,43.31 93.98,43.31 91.44,43.31 86.36,43.31 72.39,43.31 68.58,43.31 63.5,43.31 58.42,43.31 54.61,43.31 41.91,43.31 38.1,43.31 34.29,43.31 30.48,43.31 25.4,43.31 285.75,110.49 287.02,115.57 280.67,118.11 276.86,106.68 273.05,111.76 267.97,118.11 255.27,116.84 251.46,111.76 252.73,107.95 242.57,116.84 236.22,115.57 241.3,106.68 231.14,106.68 226.06,113.03 227.33,116.84 218.44,116.84 218.44,106.68 210.82,110.49 205.74,116.84 200.66,116.84 185.42,118.11 190.5,111.76 180.34,107.95 173.99,114.3 165.1,116.84 162.56,107.95 168.91,107.95 154.94,116.84 148.59,110.49 147.32,115.57 134.62,118.11 130.81,113.03 130.81,107.95 120.65,106.68 124.46,113.03 115.57,115.57 124.46,118.11 105.41,116.84 100.33,113.03 99.06,107.95 90.17,106.68 87.63,111.76 97.79,115.57 85.09,118.11 71.12,115.57 68.58,110.49 60.96,106.68 54.61,111.76 63.5,114.3 58.42,116.84 50.8,116.84 41.91,116.84 38.1,111.76 40.64,107.95 35.56,107.95 27.94,111.76 27.94,109.22 33.02,116.84 19.05,118.11 11.43,116.84 3.81,111.76 7.62,107.95 5.08,101.6 6.35,93.98 7.62,85.09 10.16,80.01 3.81,71.12 10.16,67.31 11.43,60.96 3.81,57.15 7.62,52.07 11.43,39.37 5.08,36.83
  pour Top (isolate 0.508, rank 2, no thermals): 0,120.65 394.97,120.65 394.97,36.83 400.05,31.75 415.29,31.75 415.29,26.67 425.45,26.67 425.45,8.89 0,8.89
  pour Route2 (isolate 0.508, rank 2, no thermals): 0,120.65 394.97,120.65 394.97,36.83 400.05,31.75 415.29,31.75 415.29,26.67 425.45,26.67 425.45,8.89 0,8.89
  pour Route15 (isolate 0.508, rank 2, no thermals): 0,120.65 394.97,120.65 394.97,36.83 400.05,31.75 415.29,31.75 415.29,26.67 425.45,26.67 425.45,8.89 0,8.89
  pour Bottom (isolate 0.508, rank 2, no thermals): 0,120.65 394.97,120.65 394.97,36.83 400.05,31.75 415.29,31.75 415.29,26.67 425.45,26.67 425.45,8.89 0,8.89
GPIO0
  Route2 0.406: 381,99.06 X7.A3 | X7.A3 383.54,99.19 384.81,100.46 388.62,100.46 391.16,103 JP2.2 | X7.A3 X10_AUX.A3 354.33,99.19 353.06,100.46 323.85,100.46 322.58,99.19 X6.A3 316.23,99.19 314.96,100.46 262.89,100.46 261.62,99.19 X5.A3 255.27,99.19 254,100.46 201.93,100.46 200.66,99.19 X4.A3 194.31,99.19 193.04,100.46 140.97,100.46 139.7,99.19 X3.A3 134.62,99.19 133.35,100.46 110.49,100.46 109.22,99.19 X9_AUX.A3 104.14,99.19 102.87,100.46 80.01,100.46 78.74,99.19 X2.A3 73.66,99.19 72.39,100.46 49.53,100.46 48.26,99.19 X8_AUX.A3 43.18,99.19 41.91,100.46 17.78,100.46 16.51,99.19 X1.A3
GPIO1
  Route2 0.406: 386.08,99.06 X7.C3 | X7.C3 384.81,99.19 383.54,97.92 354.33,97.92 353.06,99.19 X10_AUX.C3 X6.C3 323.85,99.19 322.58,97.92 314.96,97.92 313.69,99.19 X5.C3 262.89,99.19 261.62,97.92 254,97.92 252.73,99.19 X4.C3 201.93,99.19 200.66,97.92 193.04,97.92 191.77,99.19 X3.C3 140.97,99.19 139.7,97.92 133.35,97.92 132.08,99.19 X9_AUX.C3 110.49,99.19 109.22,97.92 102.87,97.92 101.6,99.19 X2.C3 80.01,99.19 78.74,97.92 72.39,97.92 71.12,99.19 X8_AUX.C3 49.53,99.19 48.26,97.92 41.91,97.92 40.64,99.19 X1.C3 | JP2.4 391.16,100.46 389.89,99.19 X7.C3
GPIO2
  Route2 0.406: JP2.6 384.81,97.92 383.54,96.65 X7.A4 X10_AUX.A4 354.33,96.65 353.06,97.92 323.85,97.92 322.58,96.65 X6.A4 313.69,96.65 312.42,97.92 262.89,97.92 261.62,96.65 X5.A4 252.73,96.65 251.46,97.92 201.93,97.92 200.66,96.65 X4.A4 191.77,96.65 190.5,97.92 140.97,97.92 139.7,96.65 X3.A4 132.08,96.65 130.81,97.92 110.49,97.92 109.22,96.65 X9_AUX.A4 101.6,96.65 100.33,97.92 80.01,97.92 78.74,96.65 X2.A4 71.12,96.65 69.85,97.92 49.53,97.92 48.26,96.65 X8_AUX.A4 40.64,96.65 39.37,97.92 17.78,97.92 16.51,96.65 X1.A4
GPIO3
  Route2 0.406: JP2.8 391.16,96.65 X7.C4 384.81,96.65 383.54,95.38 354.33,95.38 353.06,96.65 X10_AUX.C4 X6.C4 323.85,96.65 322.58,95.38 312.42,95.38 311.15,96.65 X5.C4 262.89,96.65 261.62,95.38 251.46,95.38 250.19,96.65 X4.C4 201.93,96.65 200.66,95.38 190.5,95.38 189.23,96.65 X3.C4 140.97,96.65 139.7,95.38 130.81,95.38 129.54,96.65 X9_AUX.C4 110.49,96.65 109.22,95.38 100.33,95.38 99.06,96.65 X2.C4 80.01,96.65 78.74,95.38 69.85,95.38 68.58,96.65 X8_AUX.C4 49.53,96.65 48.26,95.38 39.37,95.38 38.1,96.65 X1.C4
GPIO4
  Route2 0.406: JP2.10 384.81,92.84 383.54,91.57 X7.A6 X10_AUX.A6 354.33,91.57 353.06,92.84 323.85,92.84 322.58,91.57 X6.A6 308.61,91.57 307.34,92.84 262.89,92.84 261.62,91.57 X5.A6 247.65,91.57 246.38,92.84 201.93,92.84 200.66,91.57 X4.A6 186.69,91.57 185.42,92.84 140.97,92.84 139.7,91.57 X3.A6 127,91.57 125.73,92.84 110.49,92.84 109.22,91.57 X9_AUX.A6 96.52,91.57 95.25,92.84 80.01,92.84 78.74,91.57 X2.A6 66.04,91.57 64.77,92.84 49.53,92.84 48.26,91.57 X8_AUX.A6 35.56,91.57 34.29,92.84 17.78,92.84 16.51,91.57 X1.A6
GPIO5
  Route2 0.406: JP2.12 391.16,91.57 X7.C6 384.81,91.57 383.54,90.3 354.33,90.17 353.06,91.44 350.65,91.44 X10_AUX.C6 350.39,91.44 X6.C6 323.85,91.57 322.58,90.3 307.34,90.3 306.07,91.57 X5.C6 262.89,91.57 261.62,90.3 246.38,90.3 245.11,91.57 X4.C6 201.93,91.57 200.66,90.3 185.42,90.3 184.15,91.57 X3.C6 140.97,91.57 139.7,90.3 125.73,90.3 124.46,91.57 X9_AUX.C6 110.49,91.57 109.22,90.3 95.25,90.3 93.98,91.57 X2.C6 80.01,91.57 78.74,90.3 64.77,90.3 63.5,91.57 X8_AUX.C6 49.53,91.57 48.26,90.3 34.29,90.3 33.02,91.57 X1.C6
  Route15 0.406: 386.08,91.44 X7.C6
GPIO6
  Route2 0.406: JP2.14 389.89,90.3 384.81,90.3 383.54,89.03 X7.A7 X10_AUX.A7 354.33,89.03 353.06,90.3 323.85,90.3 322.58,89.03 X6.A7 306.07,89.03 304.8,90.3 262.89,90.3 261.62,89.03 X5.A7 245.11,89.03 243.84,90.3 201.93,90.3 200.66,89.03 X4.A7 184.15,89.03 182.88,90.3 140.97,90.3 139.7,89.03 X3.A7 124.46,89.03 123.19,90.3 110.49,90.3 109.22,89.03 X9_AUX.A7 93.98,89.03 92.71,90.3 80.01,90.3 78.74,89.03 X2.A7 63.5,89.03 62.23,90.3 49.53,90.3 48.26,89.03 X8_AUX.A7 33.02,89.03 31.75,90.3 17.78,90.3 16.51,89.03 X1.A7
GPIO7
  Route2 0.406: JP2.16 388.62,89.03 X7.C7 384.81,89.03 383.54,87.76 354.33,87.76 353.06,89.03 X10_AUX.C7 X6.C7 323.85,89.03 322.58,87.76 304.8,87.76 303.53,89.03 X5.C7 262.89,89.03 261.62,87.76 243.84,87.76 242.57,89.03 X4.C7 201.93,89.03 200.66,87.76 182.88,87.76 181.61,89.03 X3.C7 140.97,89.03 139.7,87.76 123.19,87.76 121.92,89.03 X9_AUX.C7 110.49,89.03 109.22,87.76 92.71,87.76 91.44,89.03 X2.C7 80.01,89.03 78.74,87.76 62.23,87.76 60.96,89.03 X8_AUX.C7 49.53,89.03 48.26,87.76 31.75,87.76 30.48,89.03 X1.C7
  Route15 0.406: 386.08,88.9 X7.C7
GPIO#0
  Route2 0.254: 401.32,96.65 403.86,96.65 403.86,91.57
  Route2 0.406: JP2.1 401.32,96.65 | TEENSY.A14 405.13,90.3 403.86,91.57
GPIO#1
  Route2 0.406: JP2.3 400.05,95.38 TEENSY.22/A8
GPIO#2
  Route2 0.406: JP2.5 400.05,92.84 TEENSY.21/A7
GPIO#3
  Route2 0.406: JP2.7 400.05,90.3 TEENSY.20/A6
GPIO#4
  Route2 0.406: JP2.9 398.78,89.03 398.78,86.49 TEENSY.17/A3
GPIO#5
  Route2 0.406: JP2.11 397.51,87.76 397.51,85.22 TEENSY.16/A2
GPIO#6
  Route2 0.406: JP2.13 396.24,86.49 396.24,83.95 TEENSY.15/A1
GPIO#7
  Route2 0.406: JP2.15 394.97,82.68 TEENSY.14/A0
HV
  Route2 0.406: X7.C26 X7.A26 JP1.1 X10_AUX.A26 X10_AUX.C26 X6.C26 X6.A26 X5.C26 X5.A26 X4.C26 X4.A26 X3.C26 X3.A26 X9_AUX.C26 X9_AUX.A26 X2.C26 X2.A26 X8_AUX.C26 X8_AUX.A26 X1.C26 X1.A26
HV_INTERLOCK  (1 unrouted)
  Route2 0.406: TEENSY.6 419.1,86.49 419.1,54.74 417.83,53.47 402.59,53.47 394.97,45.85 X7.C24 X7.A24 X10_AUX.A24 X10_AUX.C24 X6.C24 X6.A24 X5.C24 X4.C24 X4.A24 X3.C24 X3.A24 X9_AUX.C24 X9_AUX.A24 X2.C24 X2.A24 X8_AUX.C24 X8_AUX.A24 X1.C24 X1.A24
I2C_SCL
  Route15 0.406: TEENSY.19/A5 401.32,87.76 391.16,77.6 391.16,72.52 389.89,71.25 X7.C14
  Bottom 0.406: 386.08,71.12 X7.C14 384.81,71.25 383.54,69.98 354.33,69.98 353.06,71.25 X10_AUX.C14 X6.C14 323.85,71.25 322.58,69.98 289.56,69.98 288.29,71.25 X5.C14 262.89,71.25 261.62,69.98 228.6,69.98 227.33,71.25 X4.C14 201.93,71.25 200.66,69.98 167.64,69.98 166.37,71.25 X3.C14 140.97,71.25 139.7,69.98 133.35,69.98 132.08,71.25 X9_AUX.C14 110.49,71.25 109.22,69.98 102.87,69.98 101.6,71.25 X2.C14 80.01,71.25 78.74,69.98 72.39,69.98 71.12,71.25 X8_AUX.C14 49.53,71.25 48.26,69.98 41.91,69.98 40.64,71.25 X1.C14
I2C_SDA
  Route15 0.406: X7.A14 383.54,71.25 384.81,69.98 391.16,69.98 392.43,71.25 392.43,76.33 401.32,85.22 TEENSY.18/A4
  Bottom 0.406: X7.A14 X10_AUX.A14 354.33,71.25 353.06,72.52 323.85,72.52 322.58,71.25 X6.A14 290.83,71.25 289.56,72.52 262.89,72.52 261.62,71.25 X5.A14 229.87,71.25 228.6,72.52 201.93,72.52 200.66,71.25 X4.A14 168.91,71.25 167.64,72.52 140.97,72.52 139.7,71.25 X3.A14 134.62,71.25 133.35,72.52 110.49,72.52 109.22,71.25 X9_AUX.A14 104.14,71.25 102.87,72.52 80.01,72.52 78.74,71.25 X2.A14 73.66,71.25 72.39,72.52 49.53,72.52 48.26,71.25 X8_AUX.A14 43.18,71.25 41.91,72.52 17.78,72.52 16.51,71.25 X1.A14
N$1  (via drill 0.7)
  Route2 0.762: v422.91,34.29 422.91,35.05
  Route2 1.27: 422.91,35.05 422.91,114.05 417.58,119.38 v412.75,119.38
  Bottom 0.406: U1.2 411.99,116.81
  Bottom 0.762: U1.1 411.43,117.09 | 411.43,117.09 U1.2 | C4.P$2 411.99,117.09 411.43,117.09 | L1.P$2 422.91,32.07 v422.91,34.29
  Bottom 1.27: 411.99,117.09 411.99,118.62 v412.75,119.38
N$2
  Bottom 0.406: TEENSY.VUSB 407.86,103 D1.A
N$5
  Bottom 0.762: U1.5 411.54,111.26 R3.P$1 413.52,111.25 R4.P$2
SPI_CS1
  Route15 0.254: 416.56,78.87 419.1,78.87
  Route15 0.406: 419.1,78.87 421.64,76.33 421.64,54.74 414.02,47.12 377.19,47.12 369.57,54.74 346.71,54.74 344.17,57.28 316.23,57.28 313.69,59.82 255.27,59.82 252.73,62.36 194.31,62.36 191.77,64.9 133.35,64.9 130.81,67.44 102.87,67.44 100.33,69.98 72.39,69.98 69.85,72.52 41.91,72.52 38.1,76.33 X1.C12 | 416.56,78.87 TEENSY.24
SPI_CS2
  Route15 0.254: 414.02,76.33 414.02,69.98 | 403.86,66.17 403.86,57.28
  Route15 0.406: TEENSY.26 414.02,76.33 | 414.02,69.98 411.48,67.44 405.13,67.44 403.86,66.17 | 403.86,57.28 398.78,52.2 377.19,52.2 369.57,59.82 346.71,59.82 344.17,62.36 316.23,62.36 313.69,64.9 255.27,64.9 252.73,67.44 194.31,67.44 191.77,69.98 133.35,69.98 130.81,72.52 102.87,72.52 99.06,76.33 X2.C12
SPI_CS3
  Route15 0.254: 408.94,73.79 408.94,71.25
  Route15 0.406: 408.94,71.25 407.67,69.98 402.59,69.98 398.78,66.17 398.78,58.55 397.51,57.28 377.19,57.28 369.57,64.9 346.71,64.9 344.17,67.44 316.23,67.44 313.69,69.98 255.27,69.98 252.73,72.52 194.31,72.52 190.5,76.33 X3.C12 | 408.94,73.79 TEENSY.28
SPI_CS4
  Route15 0.254: 403.86,73.79 401.32,73.79
  Route15 0.406: 403.86,73.79 405.13,75.06 TEENSY.29 | 401.32,73.79 400.05,72.52 400.05,69.98 397.51,67.44 397.51,61.09 396.24,59.82 377.19,59.82 369.57,67.44 346.71,67.44 344.17,69.98 316.23,69.98 313.69,72.52 255.27,72.52 251.46,76.33 X4.C12
SPI_CS5
  Route15 0.254: 405.13,76.33 400.05,76.33
  Route15 0.406: 405.13,76.33 406.4,77.6 TEENSY.30 | 400.05,76.33 396.24,72.52 396.24,63.63 394.97,62.36 377.19,62.36 369.57,69.98 346.71,69.98 344.17,72.52 316.23,72.52 312.42,76.33 X5.C12
SPI_CS6
  Route15 0.254: 405.13,78.87 400.05,78.87
  Route15 0.406: 405.13,78.87 406.4,80.14 TEENSY.31 | 400.05,78.87 394.97,73.79 394.97,66.17 393.7,64.9 377.19,64.9 369.57,72.52 346.71,72.52 342.9,76.33 X6.C12
SPI_CS7
  Route15 0.254: 403.86,89.03 391.16,89.03
  Route15 0.406: 391.16,89.03 388.62,86.49 388.62,78.87 X7.C12 | TEENSY.33 403.86,89.03
SPI_CS8_AUX
  Route15 0.254: 416.56,76.33 416.56,68.71 | 406.4,64.9 406.4,57.28
  Route15 0.406: 416.56,68.71 414.02,66.17 407.67,66.17 406.4,64.9 | 406.4,57.28 398.78,49.66 377.19,49.66 369.57,57.28 346.71,57.28 344.17,59.82 316.23,59.82 313.69,62.36 255.27,62.36 252.73,64.9 194.31,64.9 191.77,67.44 133.35,67.44 130.81,69.98 102.87,69.98 100.33,72.52 72.39,72.52 68.58,76.33 X8_AUX.C12 | 416.56,76.33 TEENSY.25
SPI_CS9_AUX
  Route15 0.254: 411.48,76.33 411.48,69.98
  Route15 0.406: 411.48,69.98 410.21,68.71 403.86,68.71 400.05,64.9 400.05,56.01 398.78,54.74 377.19,54.74 369.57,62.36 346.71,62.36 344.17,64.9 316.23,64.9 313.69,67.44 255.27,67.44 252.73,69.98 194.31,69.98 191.77,72.52 133.35,72.52 129.54,76.33 X9_AUX.C12 | 411.48,76.33 TEENSY.27
SPI_CS10_AUX
  Route15 0.254: 403.86,81.41 400.05,81.41
  Route15 0.406: 403.86,81.41 405.13,82.68 TEENSY.32 | 400.05,81.41 393.7,75.06 393.7,68.71 392.43,67.44 377.19,67.44 369.57,75.06 354.33,75.06 353.06,76.33 X10_AUX.C12
SPI_MISO
  Route2 0.406: X7.C13 396.24,73.79 400.05,69.98 417.83,69.85 TEENSY.12
  Bottom 0.406: X7.C13 384.81,73.79 383.54,72.52 354.33,72.52 353.06,73.79 X10_AUX.C13 X6.C13 323.85,73.79 322.58,72.52 292.1,72.52 290.83,73.79 X5.C13 262.89,73.79 261.62,72.52 231.14,72.52 229.87,73.79 X4.C13 201.93,73.79 200.66,72.52 170.18,72.52 168.91,73.79 X3.C13 140.97,73.79 139.7,72.52 135.89,72.52 134.62,73.79 X9_AUX.C13 110.49,73.79 109.22,72.52 105.41,72.52 104.14,73.79 X2.C13 80.01,73.79 78.74,72.52 74.93,72.52 73.66,73.79 X8_AUX.C13 49.53,73.79 48.26,72.52 44.45,72.52 43.18,73.79 X1.C13 | U2.MISO 415.29,55.88 417.83,58.42 TEENSY.12
SPI_MOSI
  Route2 0.254: 414.02,71.25 414.02,73.79
  Route2 0.406: X7.A13 383.54,73.79 384.81,75.06 397.51,75.06 401.32,71.25 414.02,71.25 | 414.02,73.79 415.29,75.06 TEENSY.11
  Route15 0.406: TEENSY.11 419.1,75.06 420.37,73.79 420.37,63.5 417.83,60.96 410.21,60.96 U2.MOSI
  Bottom 0.406: X7.A13 X10_AUX.A13 354.33,73.79 353.06,75.06 323.85,75.06 322.58,73.79 X6.A13 293.37,73.79 292.1,75.06 262.89,75.06 261.62,73.79 X5.A13 232.41,73.79 231.14,75.06 201.93,75.06 200.66,73.79 X4.A13 171.45,73.79 170.18,75.06 140.97,75.06 139.7,73.79 X3.A13 135.89,75.06 110.49,75.06 109.22,73.79 X9_AUX.A13 105.41,75.06 80.01,75.06 78.74,73.79 X2.A13 74.93,75.06 49.53,75.06 48.26,73.79 X8_AUX.A13 44.45,75.06 17.78,75.06 16.51,73.79 X1.A13
SPI_SCLK
  Bottom 0.406: U2.SCLK 410.21,64.9 TEENSY.13 398.78,76.33 388.62,76.33 387.35,77.6 384.81,77.6 383.54,76.33 X7.A12 X10_AUX.A12 354.33,76.33 353.06,77.6 323.85,77.6 322.58,76.33 X6.A12 293.37,76.33 292.1,77.6 262.89,77.6 261.62,76.33 X5.A12 232.41,76.33 231.14,77.6 201.93,77.6 200.66,76.33 X4.A12 171.45,76.33 170.18,77.6 140.97,77.6 139.7,76.33 X3.A12 114.3,76.33 113.03,77.6 110.49,77.6 109.22,76.33 X9_AUX.A12 83.82,76.33 82.55,77.6 80.01,77.6 78.74,76.33 X2.A12 53.34,76.33 52.07,77.6 49.53,77.6 48.26,76.33 X8_AUX.A12 22.86,76.33 21.59,77.6 17.78,77.6 16.51,76.33 X1.A12
VDD
  Bottom 0.406: D1.C 407.92,105.54
  Bottom 0.762: C6.P$2 406.16,34.54 U3.1 406.17,33.25 406.4,33.02 416.81,33.02 420.88,37.08 420.88,105.66 419.48,107.06 416.31,107.06 | U1.4 411.52,112.76 R3.P$2 413.52,112.78 C1.P$2 415.04,112.53 415.04,111.76 416.31,110.49 416.31,107.06 | TEENSY.VIN 407.92,105.54 413.26,105.54 414.78,107.06 416.31,107.06
VREF
  Top 1.27: X6.A32 X5.C32 X5.A32 X4.C32 X4.A32 X3.C32 X3.A32 X9_AUX.C32 X9_AUX.A32 X2.C32 X2.A32 X8_AUX.C32 X8_AUX.A32 X1.C32 X1.A32
  Top 1.397: X6.A32 X6.C32 X10_AUX.C32 X10_AUX.A32 X7.A32 X7.C32 IC1.1
  Bottom 0.508: R5.P$1 393.7,30.72 393.7,26.8 IC1.1
VSS  (via drill 0.7)
  other vias: 424.18,29.21 416.56,36.83 401.32,39.37 401.32,35.56 398.78,43.31 405.13,51.44 408.31,48.9 408.31,56.52 411.48,58.42 415.29,59.69 417.83,48.26 410.21,99.19 407.67,94.11 415.29,105.41 410.21,107.95 398.78,106.68 422.91,118.11 417.83,113.03 416.56,116.84 415.04,108.46 401.95,48.9 401.95,59.05
  pour Top (isolate 0.508): 396.24,120.65 425.45,120.65 425.45,27.94 416.56,27.94 416.56,33.02 401.32,33.02 396.24,38.1
  pour Route2 (isolate 0.508): 396.24,120.65 425.45,120.65 425.45,27.94 416.56,27.94 416.56,33.02 401.32,33.02 396.24,38.1
  pour Route15 (isolate 0.508): 396.24,120.65 425.45,120.65 425.45,27.94 416.56,27.94 416.56,33.02 401.32,33.02 396.24,38.1
  pour Bottom (isolate 0.508, no thermals): 396.24,120.65 425.45,120.65 425.45,27.94 416.56,27.94 416.56,33.02 401.32,33.02 396.24,38.1
WIZNET_INTERRUPT
  Bottom 0.254: 416.56,76.33 416.56,64.77
  Bottom 0.406: TEENSY.10 416.56,76.33 | 416.56,64.77 U2.INT
WIZNET_PWDN
  Bottom 0.254: 408.94,69.98 408.94,78.87 411.48,78.87
  Bottom 0.406: U2.PWDN 410.21,61.09 411.48,62.36 411.48,67.44 408.94,69.98 | TEENSY.7 411.48,78.87
WIZNET_RESET
  Bottom 0.254: 414.02,60.96 414.02,76.33
  Bottom 0.406: U2.RESET 412.75,59.69 414.02,60.96 | 414.02,76.33 TEENSY.9
WIZNET_SS
  Bottom 0.254: 411.48,76.33 411.48,69.98
  Bottom 0.406: 411.48,76.33 TEENSY.8 | 411.48,69.98 412.75,68.71 U2.SS

## Text on the board
tPlace: Eurocard Backplane | v1.0 | GND | HV | HV | HV | HV | HV | HV | HV | HV | HV! | -15V | GND | MOD1 | MOD8_AUX | MOD2 | MOD9_AUX | MOD3 | MOD4 | MOD5 | MOD6 | MOD10_AUX | MOD7 | +15V
bPlace: Eurocard Backplane | v1.0 | GND | HV | High Voltage! | -15V | GND | MOD1 | MOD8_AUX | MOD2 | MOD9_AUX | MOD3 | MOD4 | MOD5 | MOD6 | MOD10_AUX | MOD7 | +15V